# EAGLE schematic Preliminary_PCB_1.0 (EAGLE 9.6.2)
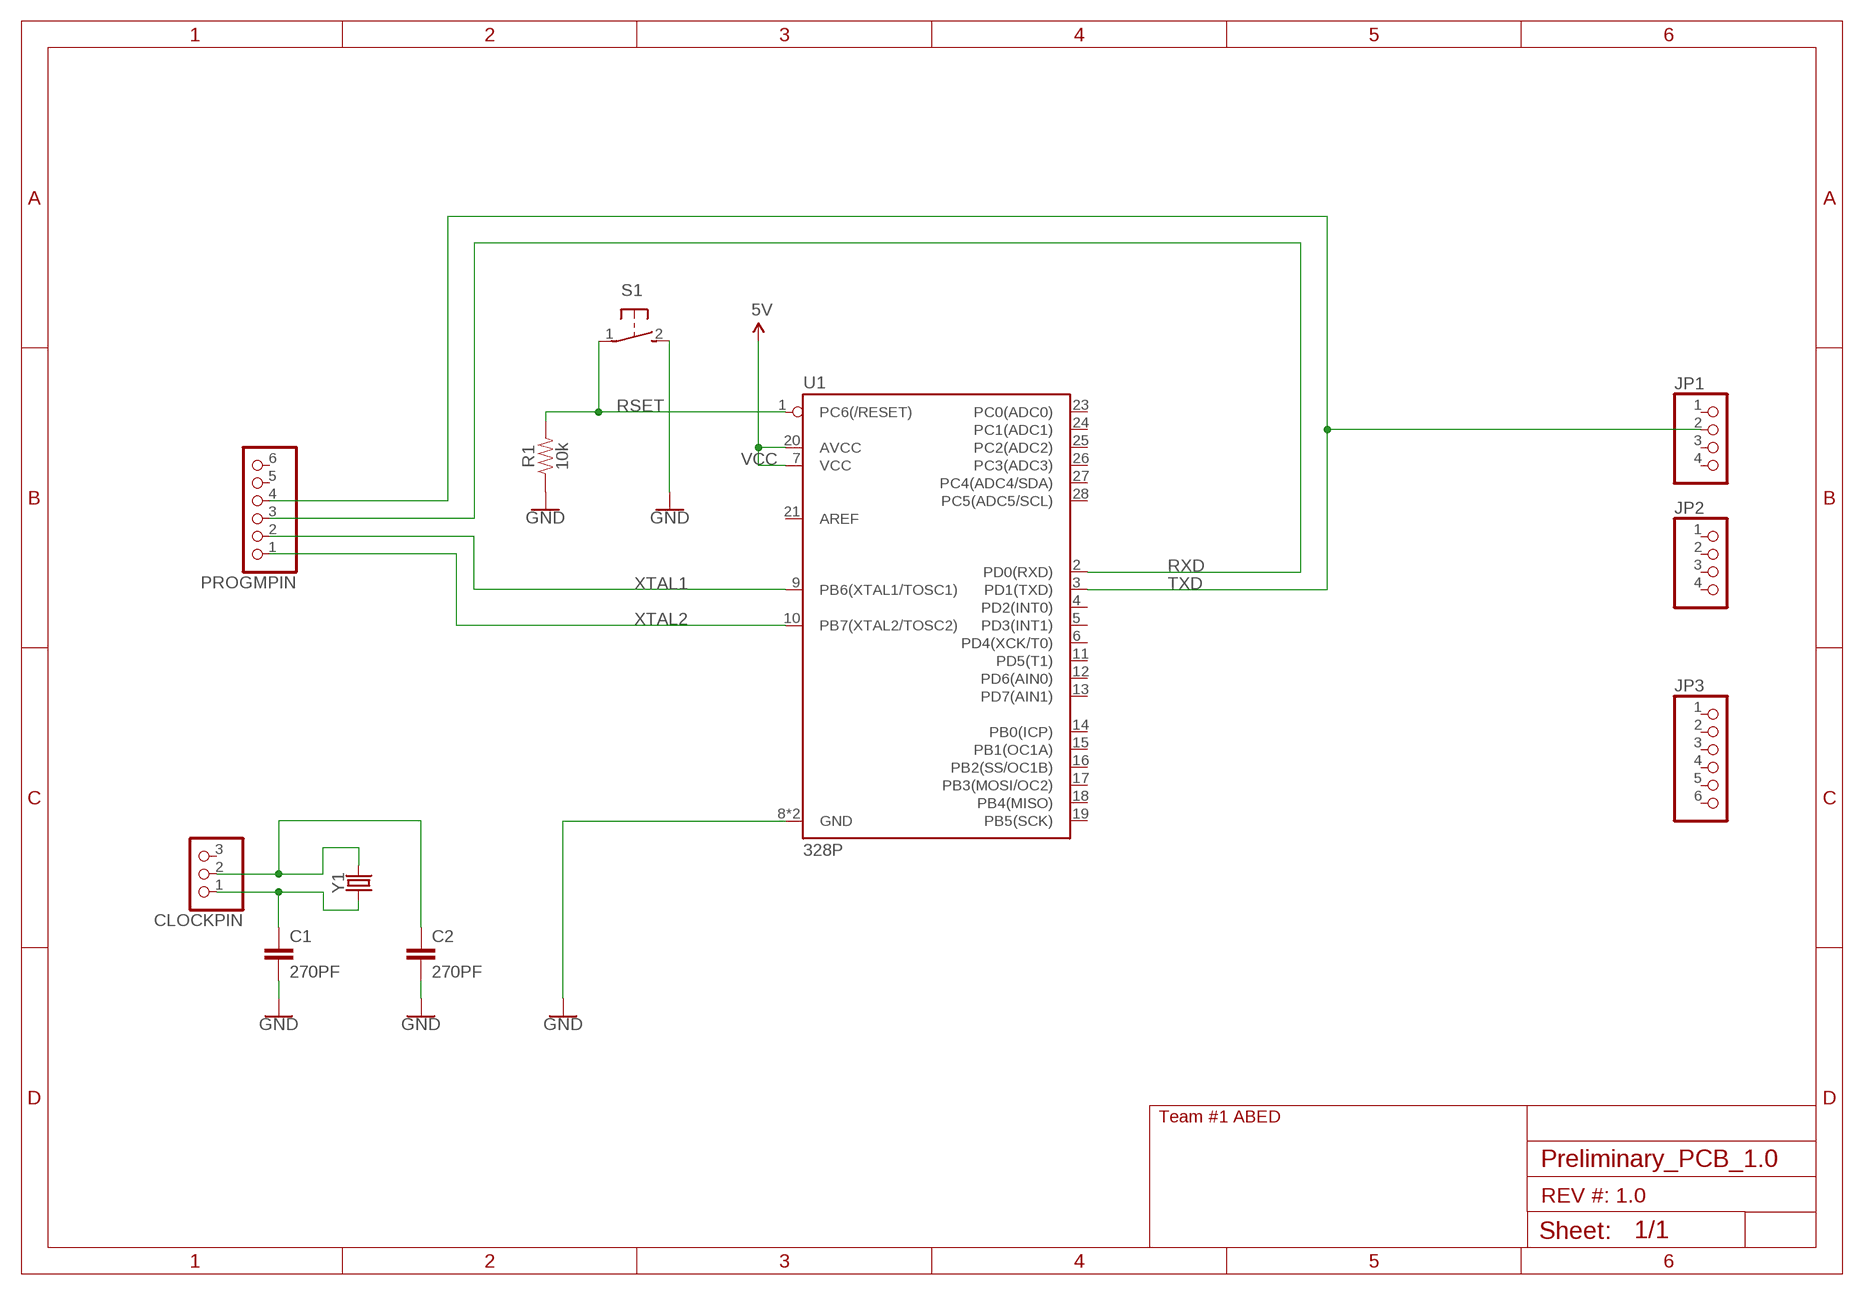
[diagram p0: schematic, sheet 1]

## Parts
C1  270PF  270PF-0603-50V-5%  [0603]
C2  270PF  270PF-0603-50V-5%  [0603]
CLOCKPIN  PINHD-1X3CB  [1X03-CLEANBIG]
JP1  PINHD-1X4  [1X04]
JP2  PINHD-1X4  [1X04]
JP3  PINHD-1X6  [1X06]
PROGMPIN  PINHD-1X6  [1X06]
R1  10k  10KOHM-HORIZ-1/4W-1%  [AXIAL-0.3]
S1  31-XX  [B3F-31XX]
U1  328P  ATMEGA328P_PDIP  [DIP28]
Y1  CRYSTALPTH-2X6  [CRYSTAL-PTH-2X6-CYL]

## Nets
GND: C1.2 C2.2 R1.P$1 S1.2(S) U1.8(GND) U1.22(GND)
N$6: C2.1 CLOCKPIN.2 Y1.2
N$7: C1.1 CLOCKPIN.1 Y1.1
RSET: R1.P$2 S1.1(P) U1.1(PC6(/RESET))
RXD: PROGMPIN.3 U1.2(PD0(RXD))
TXD: JP1.2 PROGMPIN.4 U1.3(PD1(TXD))
VCC: U1.7(VCC) U1.20(AVCC) ; supply symbol labelled 5V
XTAL1: PROGMPIN.2 U1.9(PB6(XTAL1/TOSC1))
XTAL2: PROGMPIN.1 U1.10(PB7(XTAL2/TOSC2))
Unconnected: CLOCKPIN.3 JP1.1 JP1.3 JP1.4 JP2.1 JP2.2 JP2.3 JP2.4 JP3.1 JP3.2 JP3.3 JP3.4 JP3.5 JP3.6 PROGMPIN.5 PROGMPIN.6 U1.4(PD2(INT0)) U1.5(PD3(INT1)) U1.6(PD4(XCK/T0)) U1.11(PD5(T1)) U1.12(PD6(AIN0)) U1.13(PD7(AIN1)) U1.14(PB0(ICP)) U1.15(PB1(OC1A)) U1.16(PB2(SS/OC1B)) U1.17(PB3(MOSI/OC2)) U1.18(PB4(MISO)) U1.19(PB5(SCK)) U1.21(AREF) U1.23(PC0(ADC0)) U1.24(PC1(ADC1)) U1.25(PC2(ADC2)) U1.26(PC3(ADC3)) U1.27(PC4(ADC4/SDA)) U1.28(PC5(ADC5/SCL))

## Notes on the sheet
- Team #1 ABED
- REV #: 1.0

## Library data of the parts
C1 C2 = SparkFun-Capacitors:270PF: 270pF/0.27nF ceramic capacitors A capacitor is a passive two-terminal electrical component used to store electrical energy temporarily in an electric field.; PROD_ID: CAP-13339
CLOCKPIN = adafruit:PINHD-1X3: PIN HEADER
JP1 JP2 = pinhead:PINHD-1X4: PIN HEADER
JP3 = pinhead:PINHD-1X6: PIN HEADER
PROGMPIN = adafruit:PINHD-1X6: PIN HEADER
R1 = SparkFun-Resistors:10KOHM: 10kΩ resistor A resistor is a passive two-terminal electrical component that implements electrical resistance as a circuit element. Resistors act to reduce current flow, and, at the same time, act to lower voltage levels within circuits. - Wikipedia; PROD_ID: RES-12183
S1 = adafruit:31-XX: OMRON SWITCH Now with beefier pads!
U1 = SparkFun-IC-Microcontroller:ATMEGA328P_PDIP: Atmel 328P Through hole ATMEGA328P uC used in the Arduino 32kb flash, 1k EEPROM, 2k SRAM Datasheet <http://www.sparkfun.com/datasheets/Components/SMD/ATMega328.pdf> SparkFun Products Storefront component: AVR 28 Pin 20MHz 32K 6A/D - ATMega328P <https://www.sparkfun.com/products/9061> (COM-09061) SparkFun Simon Says - Through-Hole Soldering Kit <https://www.sparkfun.com/products/10547> (KIT-10547) SparkFun Learn to Solder - Simon Says <https://www.sparkfun.com/products/13708> (KIT-13708) SparkFun BigTime Watch Kit <https://www.sparkfun.com/products/11734> (KIT-11734) SparkFun ClockIt <https://www.sparkfun.com/products/10930> (KIT-10930) SparkFun Serial Enabled LCD Kit <https://www.sparkfun.com/products/10097> (LCD-10097) SparkFun Simon Tilts - Through Hole Soldering Kit <https://www.sparkfun.com/products/12634> (KIT-12634) SparkFun Frequency Counter Kit <https://www.sparkfun.com/products/10140> (KIT-10140) FabFM Radio Kit <https://www.sparkfun.com/products/11043> (KIT-11043) SparkFun Binary Blaster Kit <https://www.sparkfun.com/products/12037> (KIT-12037) SparkFun Metro-Gnome <https://www.sparkfun.com/products/9236> (KIT-09236) ATmega328 with Arduino Optiboot (Uno) <https://www.sparkfun.com/products/10524> (DEV-10524); PROD_ID: IC-09136
Y1 = SparkFun-Clocks:CRYSTAL: Crystals (Generic) These are passive quartz crystals, which can be used as a clock source for a microcontroller. Crystal's are two-terminal devices. They require external "load" capacitors to generate an oscillating signal.